# EAGLE design Multi_PWS_V1p0 (EAGLE 9.6.2)
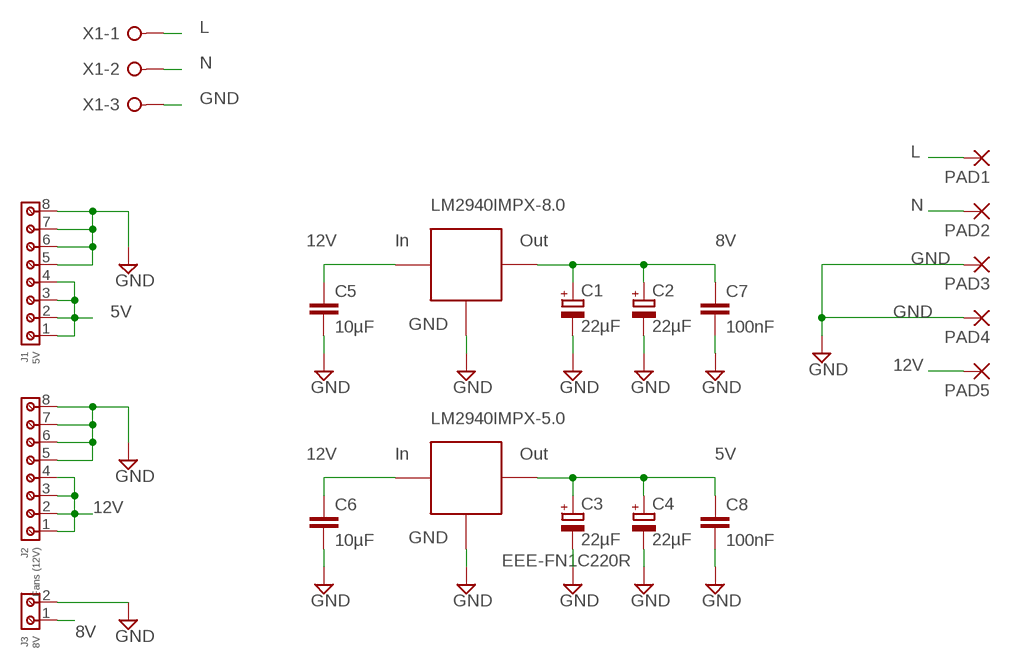
[diagram p0: schematic, sheet 1]

## Parts
C1  22µF  CPOL-EUB  [PANASONIC_B]
C2  22µF  CPOL-EUB  [PANASONIC_B]
C3  22µF  CPOL-EUB  [PANASONIC_B]
C4  22µF  CPOL-EUB  [PANASONIC_B]
C5  10µF  C-EUC1210  [C1210]
C6  10µF  C-EUC1210  [C1210]
C7  100nF  C-EUC1210  [C1210]
C8  100nF  C-EUC1210  [C1210]
J1  5V  691210910008  [691210910008]
J2  Fans (12V)  691210910008  [691210910008]
J3  8V  691210910002  [691210910002]
PAD1  SMD5  [SMD2,54-5,08]
PAD2  SMD5  [SMD2,54-5,08]
PAD3  SMD5  [SMD2,54-5,08]
PAD4  SMD5  [SMD2,54-5,08]
PAD5  SMD5  [SMD2,54-5,08]
U$1  LM2940IMPX-8.0  LM2940IMP  [SOT223]
U$2  LM2940IMPX-5.0  LM2940IMP  [SOT223]
X1  W237-3E  [W237-3E]

## Nets
5V: C3.+ C4.+ C8.1 J1.1 J1.2 J1.3 J1.4 U$2.3(VCC)
8V: C1.+ C2.+ C7.1 J3.1 U$1.3(VCC)
12V: C5.1 C6.1 J2.1 J2.2 J2.3 J2.4 PAD5.1(P) U$1.1(IN) U$2.1(IN)
GND: C1.- C2.- C3.- C4.- C5.2 C6.2 C7.2 C8.2 J1.5 J1.6 J1.7 J1.8 J2.5 J2.6 J2.7 J2.8 J3.2 PAD3.1(P) PAD4.1(P) U$1.2(GND) U$1.4(GND) U$2.2(GND) U$2.4(GND) X1.3
L: PAD1.1(P) X1.1
N: PAD2.1(P) X1.2

## Notes on the sheet
- EEE-FN1C220R

## Library data of the parts
C1-C4 = rcl:CPOL-EU: POLARIZED CAPACITOR, European symbol; SPICEPREFIX: C
C5-C8 = rcl:C-EU: CAPACITOR, European symbol; SPICEPREFIX: C
J1 J2 = Wurth_Connectors_WR-TBL Rising Cage Clamp:691210910008: WR-TBL Serie 2109 - 2.54 mm Horiz. Entry KIND PROPERTIES Pitch 2.54 mm MATERIAL PROPERTIES Insulator Material PA66 Insulator Flammability Rating UL94 V-0 Insulator Color Green Contact Material Brass Contact Plating Copper over Zinc Terminal Screw Material Steel Terminal Screw Plating Zinc Wire Guard Material Brass GENERAL INFORMATION Operating Temperature -40 up to +105 °C Compliance Lead free / RoHS ELECTRICAL PROPERTIES IR cULus 6 A Working Voltage [cULus] 150 V (AC) Withstanding Voltage [cULus] 1300 V (AC) Contact Resistance [cULus] 20 mΩ MECHANICAL PROPERTIES Wire Strip Length 4 up to 5 (mm) Screw M1.6 Solid Wire Section (AWG) 30 to 18 (AWG) Solid Wire Section (Metric) 0.0509 to 0.823 (mm²) Stranded Wire Section (AWG) 30 to 18 (AWG) Stranded Wire Section (Metric) 0.0509 to 0.823 (mm²) CERTIFICATION cULus Approval E315414 PACKAGING PROPERTIES Packaging Box <https://katalog.we-online.com/media/images/v2/o33231v209%20Family_WR-TBL_69121091000x.jpg> Details see: https://katalog.we-online.com/en/em/TBL_2_54_2109_HORIZONTAL_ENTRY_69121091000X Updated by Ella Wu 2019-11-12 2019(C) Wurth Elektronik; DATASHEET-URL: https://www.we-online.com/catalog/datasheet/691210910008.pdf; IR-UL: 6A; MOUNT: THT; PART-NUMBER: 691210910008; PINS: 8; PITCH: 2.54mm; TYPE: Horizontal; WIRE: 30 to 18 (AWG) 0.0509 to 0.823 (mm²); WORKING-VOLTAGE-UL: 150V (AC)
J3 = Wurth_Connectors_WR-TBL Rising Cage Clamp:691210910002: WR-TBL Serie 2109 - 2.54 mm Horiz. Entry KIND PROPERTIES Pitch 2.54 mm MATERIAL PROPERTIES Insulator Material PA66 Insulator Flammability Rating UL94 V-0 Insulator Color Green Contact Material Brass Contact Plating Copper over Zinc Terminal Screw Material Steel Terminal Screw Plating Zinc Wire Guard Material Brass GENERAL INFORMATION Operating Temperature -40 up to +105 °C Compliance Lead free / RoHS ELECTRICAL PROPERTIES IR cULus 6 A Working Voltage [cULus] 150 V (AC) Withstanding Voltage [cULus] 1300 V (AC) Contact Resistance [cULus] 20 mΩ MECHANICAL PROPERTIES Wire Strip Length 4 up to 5 (mm) Screw M1.6 Solid Wire Section (AWG) 30 to 18 (AWG) Solid Wire Section (Metric) 0.0509 to 0.823 (mm²) Stranded Wire Section (AWG) 30 to 18 (AWG) Stranded Wire Section (Metric) 0.0509 to 0.823 (mm²) CERTIFICATION cULus Approval E315414 PACKAGING PROPERTIES Packaging Box <https://katalog.we-online.com/media/images/v2/o33231v209%20Family_WR-TBL_69121091000x.jpg> Details see: https://katalog.we-online.com/en/em/TBL_2_54_2109_HORIZONTAL_ENTRY_69121091000X Updated by Ella Wu 2019-11-12 2019(C) Wurth Elektronik; DATASHEET-URL: https://www.we-online.com/catalog/datasheet/691210910002.pdf; IR-UL: 6A; MOUNT: THT; PART-NUMBER: 691210910002; PINS: 2; PITCH: 2.54mm; TYPE: Horizontal; WIRE: 30 to 18 (AWG) 0.0509 to 0.823 (mm²); WORKING-VOLTAGE-UL: 150V (AC)
PAD1-PAD5 = wirepad:SMD5: SMD PAD
U$1 U$2 = Orzada:LM2940: Voltage Regulator LM2940x fixed voltage
X1 = con-wago-508:W237-3E: WAGO SREW CLAMP; OC_FARNELL: unknown; OC_NEWARK: unknown

## Board
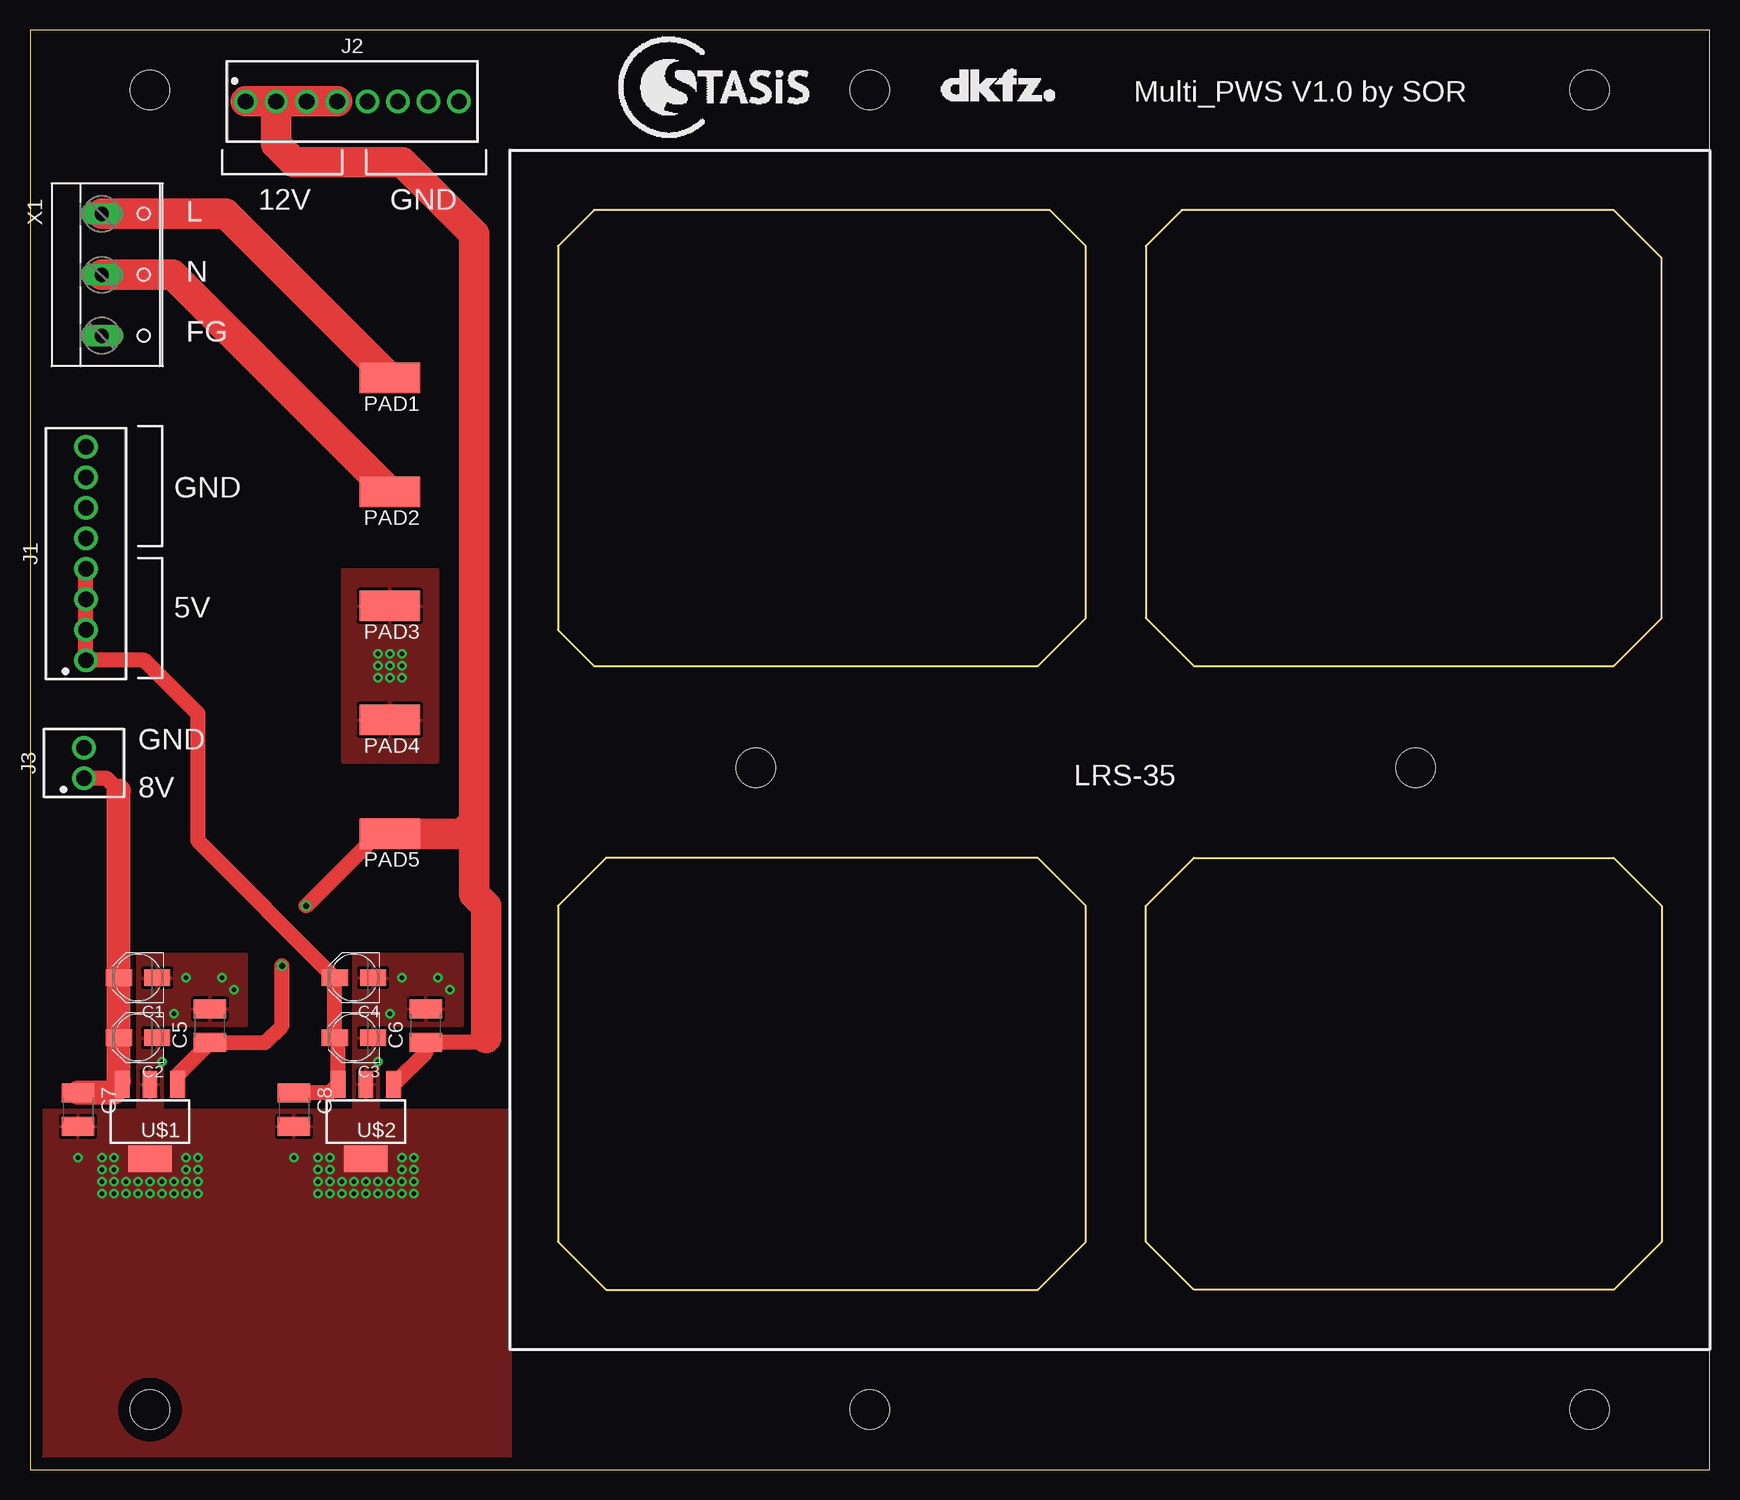
[diagram p1: board, top side]
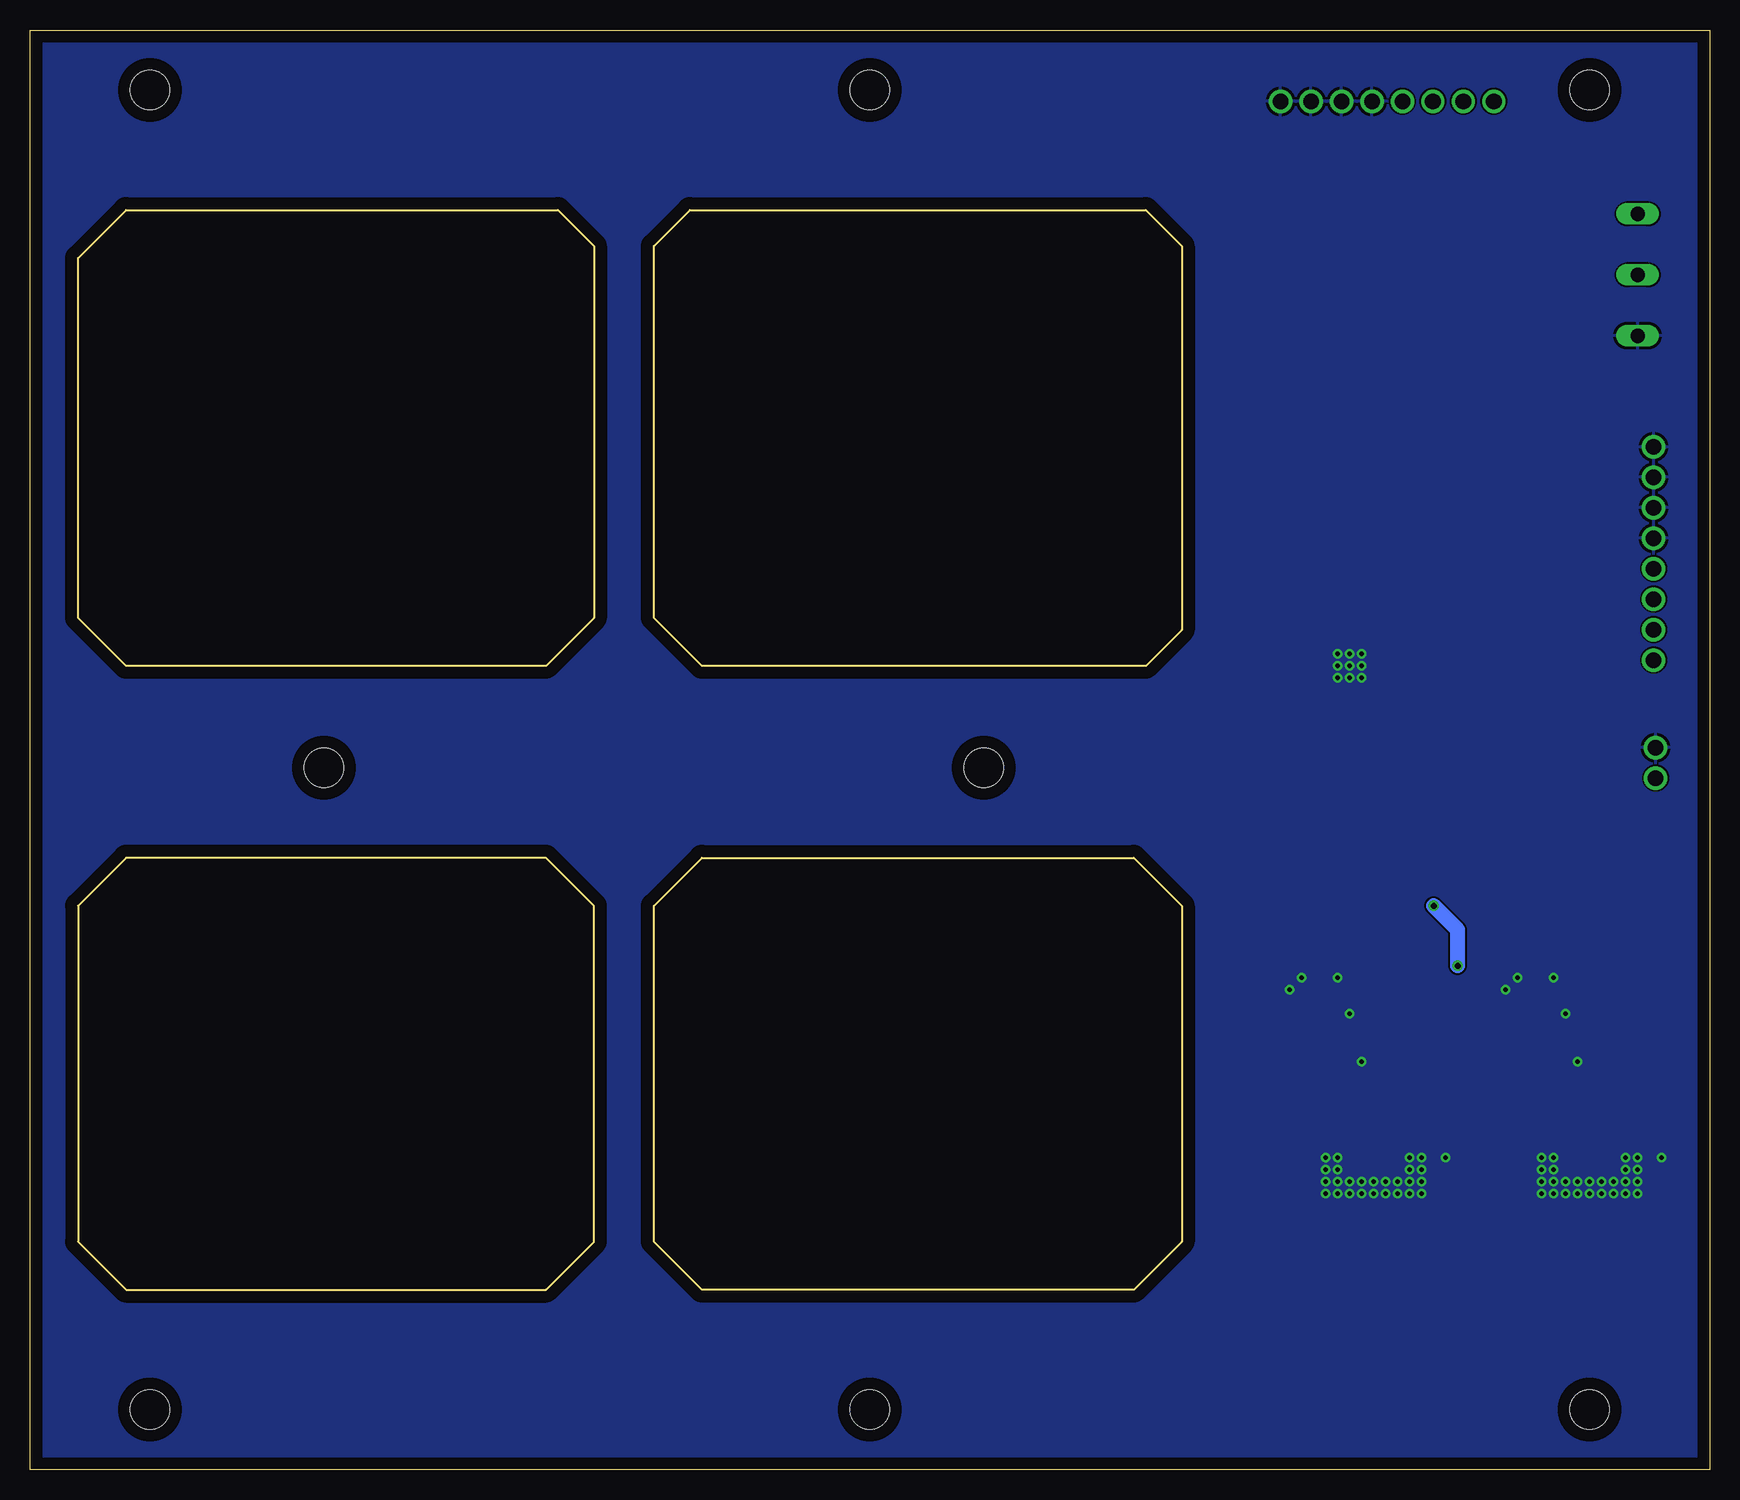
[diagram p2: board, bottom side, seen from below]

Size 140 x 120 mm. Coordinates in mm from the lower left corner, seen from the top.
Outline: 0,0 140,0 140,120 0,120 0,0
Outline: 44,47 44,19 48,15 84,15 88,19 88,47 84,51 48,51 44,47
Outline: 44,70 47,67 84,67 88,71 88,102 85,105 47,105 44,102 44,70
Outline: 93,102 93,71 97,67 132,67 136,71 136,101 132,105 96,105 93,102
Outline: 93,47 97,51 132,51 136,47 136,19 132,15 97,15 93,19 93,47
Copper layers (1*16): Top 0.035mm / dielectric 1.5mm / Bottom 0.035mm
Design rules "default": minimum track width 6mil, minimum drill 0.35mm, track to track 6mil, track to pad 6mil, pad to pad 6mil, via to via 6mil, smd to smd 6mil, copper to edge 40mil, drill to drill 6mil, minimum pad ring 10mil, minimum via ring 8mil, stop-mask expansion 4mil, vias tented up to drill 0mil, thermal gap 10mil
Holes 3.3 mm at 10,115 10,5 130,115 130,5 70,115 70,5 60.5,58.5 115.5,58.5

### Footprints (pad centres in the part's own frame; a part is rotated, then mirrored left to right if it is on the bottom)
PANASONIC_B = smd 2.2 x 1.4: + 1.6,0; - -1.6,0
C1210 = smd 1.6 x 2.7: 1 -1.4,0; 2 1.4,0
691210910008 = drill 1.3: 1 -8.89,0; 2 -6.35,0; 3 -3.81,0; 4 -1.27,0; 5 1.27,0; 6 3.81,0; 7 6.35,0; 8 8.89,0
691210910002 = drill 1.3: 1 -1.27,0; 2 1.27,0
SMD2,54-5,08 = smd 2.54 x 5.08: 1 0,0
SOT223 = smd 1.219 x 2.235: 1 -2.311,-3.099; 2 0,-3.099; 3 2.311,-3.099 | smd 3.6 x 2.2: 4 0,3.099
W237-3E = drill 1.194 long: 1 -5.08,-0.635; 2 0,-0.635; 3 5.08,-0.635

### Placement (x,y rotation side)
C1  9,41 180 top
C2  9,36 180 top
C3  27,36 180 top
C4  27,41 180 top
C5  15,37 90 top
C6  33,37 90 top
C7  4,30 270 top
C8  22,30 270 top
J1  4.65,76.36 90 top
J2  26.87,114.05 0 top
J3  4.49,58.9 90 top
PAD1  30,91 90 top
PAD2  30,81.5 90 top
PAD3  30,72 90 top
PAD4  30,62.5 90 top
PAD5  30,53 90 top
U$1  10,29 180 top
U$2  28,29 180 top
U$3  [LOGO_DKFZ]  76,114 0 top
U$4  [LOGO_STASIS]  58,115 0 top
X1  6.62,99.59 270 top

### Tracks (layer width: path | path; a pad name or v marks a point on that pad's centre or on a via)
5V
  Top 1.27: C8.1 24.99,31.4 U$2.3 25.69,35.71 C3.+ C4.+ 14,52.4 14,63 9.53,67.47 J1.1 J1.2 J1.3 J1.4
8V
  Top 1.27: 6.99,31.4 U$1.3 7.4,32.39 | 7.4,56.6 6.37,57.63 J3.1
  Top 2: 6.99,31.4 C7.1 | 7.4,32.39 C2.+ C1.+ 7.4,56.6
12V  (via drill 0.5)
  Top 1.27: 38,36 37.6,35.6 C6.1 33,34.79 U$2.1 | U$1.1 12.31,32.91 C5.1 19.6,35.6 21,37 v21,42 | v23,47 29,53 PAD5.1
  Top 2.54: PAD5.1 36,53 37,54 | 37,54 37,103 31,109 22,109 20.52,110.48 J2.2 | J2.1 J2.2 | J2.2 J2.3 J2.4 | 38,36 38,47 37,48 37,54
  Bottom 1.27: v21,42 21,45 v23,47
GND  (via drill 0.35)
  other vias: 11,34 12,38 13,41 29,34 30,38 31,41 16,41 17,40 22,26 6,26 6,25 6,24 7,24 8,24 9,24 10,24 11,24 12,24 13,24 13,26 13,25 7,26 7,25 14,26 14,25 14,24 14,23 13,23 12,23 11,23 10,23 9,23 8,23 7,23 6,23 25,26 24,26 24,25 24,24 24,23 25,23 26,23 27,23 28,23 29,23 30,23 31,23 32,23 32,24 32,25 32,26 31,26 31,25 31,24 30,24 29,24 28,24 27,24 26,24 25,24 25,25 34,41 35,40 4,26 29,68 29,66 29,67 30,68 31,67 31,66 30,67 30,66 31,68
  pour Bottom: 1,119 139,119 139,1 1,1
  pour Top (rank 6, no thermals): 7,28 13,28 13,24 7,24
  pour Top (rank 6, no thermals): 25,28 25,24 31,24 31,28
  pour Top (rank 6): 1,30 40,30 40,1 1,1
  pour Top (rank 6): 9,30 9,43 18,43 18,37 11,37 11,30
  pour Top (rank 6): 27,29 27,43 36,43 36,37 29,37 29,29
  pour Top (rank 6): 26,75 26,59 34,59 34,75
L
  Top 2.54: PAD1.1 16.33,104.67 X1.1
N
  Top 2.54: PAD2.1 11.91,99.59 X1.2

### Text on the board
tPlace: Multi_PWS V1.0 by SOR | 12V | GND | L | N | FG | GND | 5V | GND | LRS-35 | 8V